# Altium project PCB_Project.PrjPcb
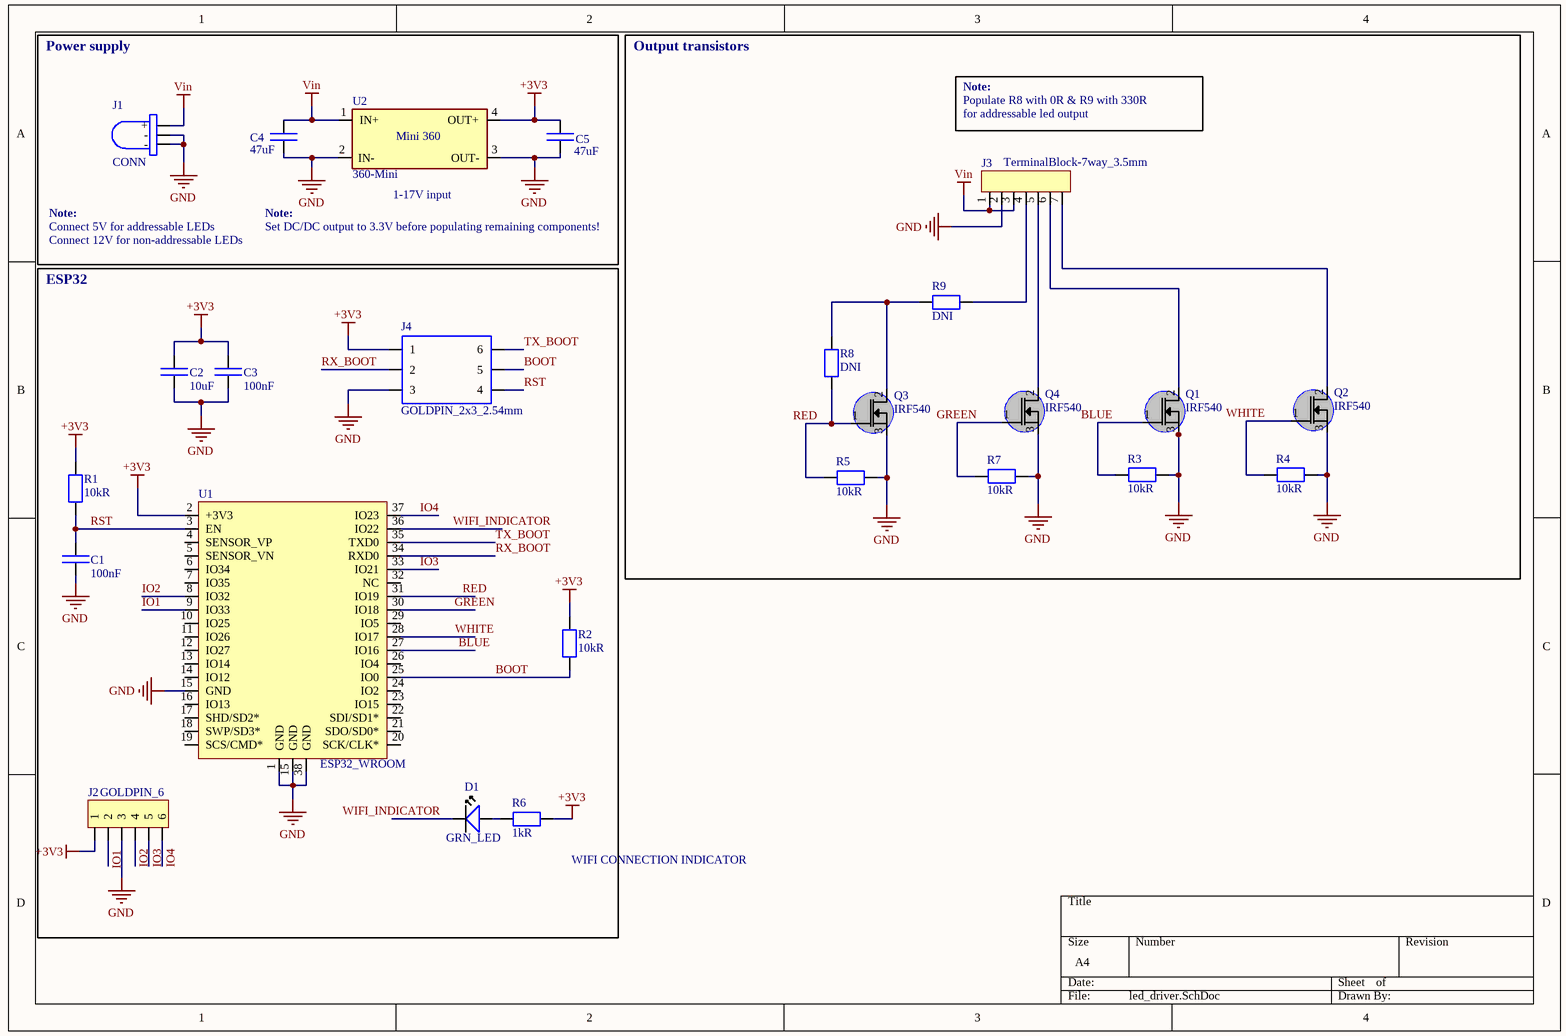
[diagram p0: led_driver.SchDoc]
1 sheet, 25 parts. Net scope: global (net labels, ports and power ports of the same name join across sheets).
Board file: led_driver.PcbDoc

## Sheet led_driver.SchDoc
size A4; SheetNumber: 1; SheetTotal: 1

### Parts
C1  100nF  [C0603]
C2  10uF  [C0603]
C3  100nF  [C0603]
C4  47uF  [C0805]
C5  47uF  [C0805]
D1  GRN_LED  [G_LED0805]
J1  CONN  [BarrelJack]
J2  GOLDPIN_6  [pin_header_6_male]
J3  TerminalBlock-7way_3.5mm  [TerminalBlock-7way]
J4  GOLDPIN_2x3_2.54mm  [PIN_HEADER_2x3_2.54mm]
Q1  IRF540  [IRF540]
Q2  IRF540  [IRF540]
Q3  IRF540  [IRF540]
Q4  IRF540  [IRF540]
R1  10kR  [R0603]
R2  10kR  [R0603]
R3  10kR  [R0603]
R4  10kR  [R0603]
R5  10kR  [R0603]
R6  1kR  [R0603]
R7  10kR  [R0603]
R8  DNI  [R0603]
R9  DNI  [R0805]
U1  ESP32_WROOM  [ESP32-WROOM-32]
U2  360-Mini  [DC-mini360-smd]

### Blocks framed on the sheet
Power supply: C4 C5 J1 U2
Output transistors: J3 Q1-Q4 R3-R5 R7-R9
ESP32: C1-C3 D1 J2 J4 R1 R2 R6 U1

### Nets
+3V3: C2.2 C3.2 C5.2 J2.1 J4.1 R1.2 R2.2 R6.2 U1.2(+3V3) U2.4(OUT+)
GND: C1.2 C2.1 C3.1 C4.1 C5.1 J1.2(-) J1.3(-) J2.3 J3.2 J4.3 Q1.3 Q2.3 Q3.3 Q4.3 R3.1 R4.1 R5.1 R7.1 U1.1(GND) U1.15(GND) U1.38(GND) U2.2(IN-) U2.3(OUT-)
Vin: C4.2 J1.1(+) J3.1 J3.3 U2.1(IN+)
BLUE: Q1.1(G) R3.2 U1.27(IO16)
BOOT: J4.5 R2.1 U1.25(IO0)
GREEN: Q4.1(G) R7.2 U1.30(IO18)
IO1: J2.2 U1.9(IO33)
IO2: J2.4 U1.8(IO32)
IO3: J2.5 U1.33(IO21)
IO4: J2.6 U1.37(IO23)
RED: Q3.1(G) R5.2 R8.2 U1.31(IO19)
RST: C1.1 J4.4 R1.1 U1.3(EN)
RX_BOOT: J4.2 U1.34(RXD0)
TX_BOOT: J4.6 U1.35(TXD0)
WHITE: Q2.1(G) R4.2 U1.28(IO17)
WIFI_INDICATOR: D1.K U1.36(IO22)
NetD1_A: D1.A R6.1
NetJ3_4: J3.4 R9.2
NetJ3_5: J3.5 Q4.2
NetJ3_6: J3.6 Q1.2
NetJ3_7: J3.7 Q2.2
NetQ3_2: Q3.2 R8.1 R9.1

Not connected (* = marked no-connect by the designer): U1 4(SENSOR_VP) 5(SENSOR_VN) 6(IO34) 7(IO35) 10(IO25) 11(IO26) 12(IO27) 13(IO14) 14(IO12) 16(IO13) 17(SHD/SD2*) 18(SWP/SD3*) 19(SCS/CMD*) 20(SCK/CLK*) 21(SDO/SD0*) 22(SDI/SD1*) 23(IO15) 24(IO2) 26(IO4) 29(IO5) 32(NC)

### Notes on the sheet
- Note:
- Populate R8 with 0R & R9 with 330R
- for addressable led output
- Connect 5V for addressable LEDs
- Connect 12V for non-addressable LEDs
- Set DC/DC output to 3.3V before populating remaining components!
- (near U2) 1-17V input
- WIFI CONNECTION INDICATOR
- (in symbol 360-Mini) Mini 360

### Library data of the parts
C1-C5 = Cap_SMD
J1 = DC-barrel
R1-R9 = Res
U1 = ESP32_WROOM: pin to pad: 38>38+39